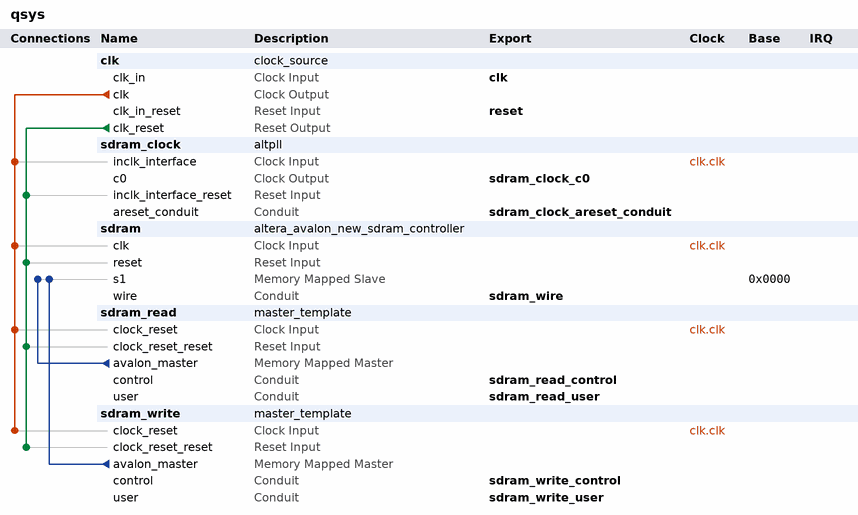
[diagram p0: system contents]
# Platform Designer (Qsys) system qsys, Cyclone IV E EP4CE22F17C6
# Parameters at their usual value, and those the tool derives, are not listed.
package require -exact qsys 15.1
create_system qsys
set_project_property DEVICE_FAMILY {Cyclone IV E}
set_project_property DEVICE EP4CE22F17C6

add_instance clk clock_source 15.1
set_instance_parameter_value clk clockFrequency 50000000

add_instance sdram_clock altpll 15.1
set_instance_parameter_value sdram_clock CLK0_DIVIDE_BY 1
set_instance_parameter_value sdram_clock CLK0_MULTIPLY_BY 1
set_instance_parameter_value sdram_clock CLK0_PHASE_SHIFT -3000
set_instance_parameter_value sdram_clock INCLK0_INPUT_FREQUENCY 20000
set_instance_parameter_value sdram_clock PORT_ARESET PORT_UNUSED
set_instance_parameter_value sdram_clock PORT_LOCKED PORT_UNUSED
set_instance_parameter_value sdram_clock PORT_clk1 PORT_UNUSED
set_instance_parameter_value sdram_clock PORT_clk2 PORT_UNUSED
set_instance_parameter_value sdram_clock PORT_clk3 PORT_UNUSED

add_instance sdram altera_avalon_new_sdram_controller 15.1
set_instance_parameter_value sdram TAC 6.5
set_instance_parameter_value sdram TRCD 20.0
set_instance_parameter_value sdram TRP 20.0
set_instance_parameter_value sdram casLatency 2
set_instance_parameter_value sdram columnWidth 9
set_instance_parameter_value sdram dataWidth 16
set_instance_parameter_value sdram generateSimulationModel false
set_instance_parameter_value sdram initRefreshCommands 8
set_instance_parameter_value sdram model single_Micron_MT48LC4M32B2_7_chip
set_instance_parameter_value sdram numberOfBanks 4
set_instance_parameter_value sdram numberOfChipSelects 1
set_instance_parameter_value sdram powerUpDelay 200.0
set_instance_parameter_value sdram refreshPeriod 0.75
set_instance_parameter_value sdram rowWidth 13

add_instance sdram_read master_template 15.1
set_instance_parameter_value sdram_read ADDRESS_WIDTH 32
set_instance_parameter_value sdram_read BURST_CAPABLE 0
set_instance_parameter_value sdram_read DATA_WIDTH 64
set_instance_parameter_value sdram_read FIFO_DEPTH 8
set_instance_parameter_value sdram_read MASTER_DIRECTION 0
set_instance_parameter_value sdram_read MAXIMUM_BURST_COUNT 2
set_instance_parameter_value sdram_read MEMORY_BASED_FIFO 0

add_instance sdram_write master_template 15.1
set_instance_parameter_value sdram_write ADDRESS_WIDTH 32
set_instance_parameter_value sdram_write BURST_CAPABLE 0
set_instance_parameter_value sdram_write DATA_WIDTH 64
set_instance_parameter_value sdram_write FIFO_DEPTH 8
set_instance_parameter_value sdram_write MASTER_DIRECTION 1
set_instance_parameter_value sdram_write MAXIMUM_BURST_COUNT 2
set_instance_parameter_value sdram_write MEMORY_BASED_FIFO 0

# connections
add_connection clk.clk sdram.clk clock
add_connection clk.clk sdram_clock.inclk_interface clock
add_connection clk.clk sdram_read.clock_reset clock
add_connection clk.clk sdram_write.clock_reset clock
add_connection clk.clk_reset sdram.reset reset
add_connection clk.clk_reset sdram_clock.inclk_interface_reset reset
add_connection clk.clk_reset sdram_read.clock_reset_reset reset
add_connection clk.clk_reset sdram_write.clock_reset_reset reset
add_connection sdram_read.avalon_master sdram.s1 avalon
set_connection_parameter_value sdram_read.avalon_master/sdram.s1 baseAddress 0x0000
add_connection sdram_write.avalon_master sdram.s1 avalon
set_connection_parameter_value sdram_write.avalon_master/sdram.s1 baseAddress 0x0000

# exported interfaces
add_interface clk clock sink
set_interface_property clk EXPORT_OF clk.clk_in
add_interface reset reset sink
set_interface_property reset EXPORT_OF clk.clk_in_reset
add_interface sdram_clock_areset_conduit conduit end
set_interface_property sdram_clock_areset_conduit EXPORT_OF sdram_clock.areset_conduit
add_interface sdram_clock_c0 clock source
set_interface_property sdram_clock_c0 EXPORT_OF sdram_clock.c0
add_interface sdram_read_control conduit end
set_interface_property sdram_read_control EXPORT_OF sdram_read.control
add_interface sdram_read_user conduit end
set_interface_property sdram_read_user EXPORT_OF sdram_read.user
add_interface sdram_wire conduit end
set_interface_property sdram_wire EXPORT_OF sdram.wire
add_interface sdram_write_control conduit end
set_interface_property sdram_write_control EXPORT_OF sdram_write.control
add_interface sdram_write_user conduit end
set_interface_property sdram_write_user EXPORT_OF sdram_write.user

set_interconnect_requirement {$system} qsys_mm.clockCrossingAdapter HANDSHAKE
set_interconnect_requirement {$system} qsys_mm.enableEccProtection FALSE
set_interconnect_requirement {$system} qsys_mm.insertDefaultSlave FALSE
set_interconnect_requirement {$system} qsys_mm.maxAdditionalLatency 1

save_system qsys.qsys
